# EAGLE schematic keyboardPCB2 (EAGLE 9.2.2)
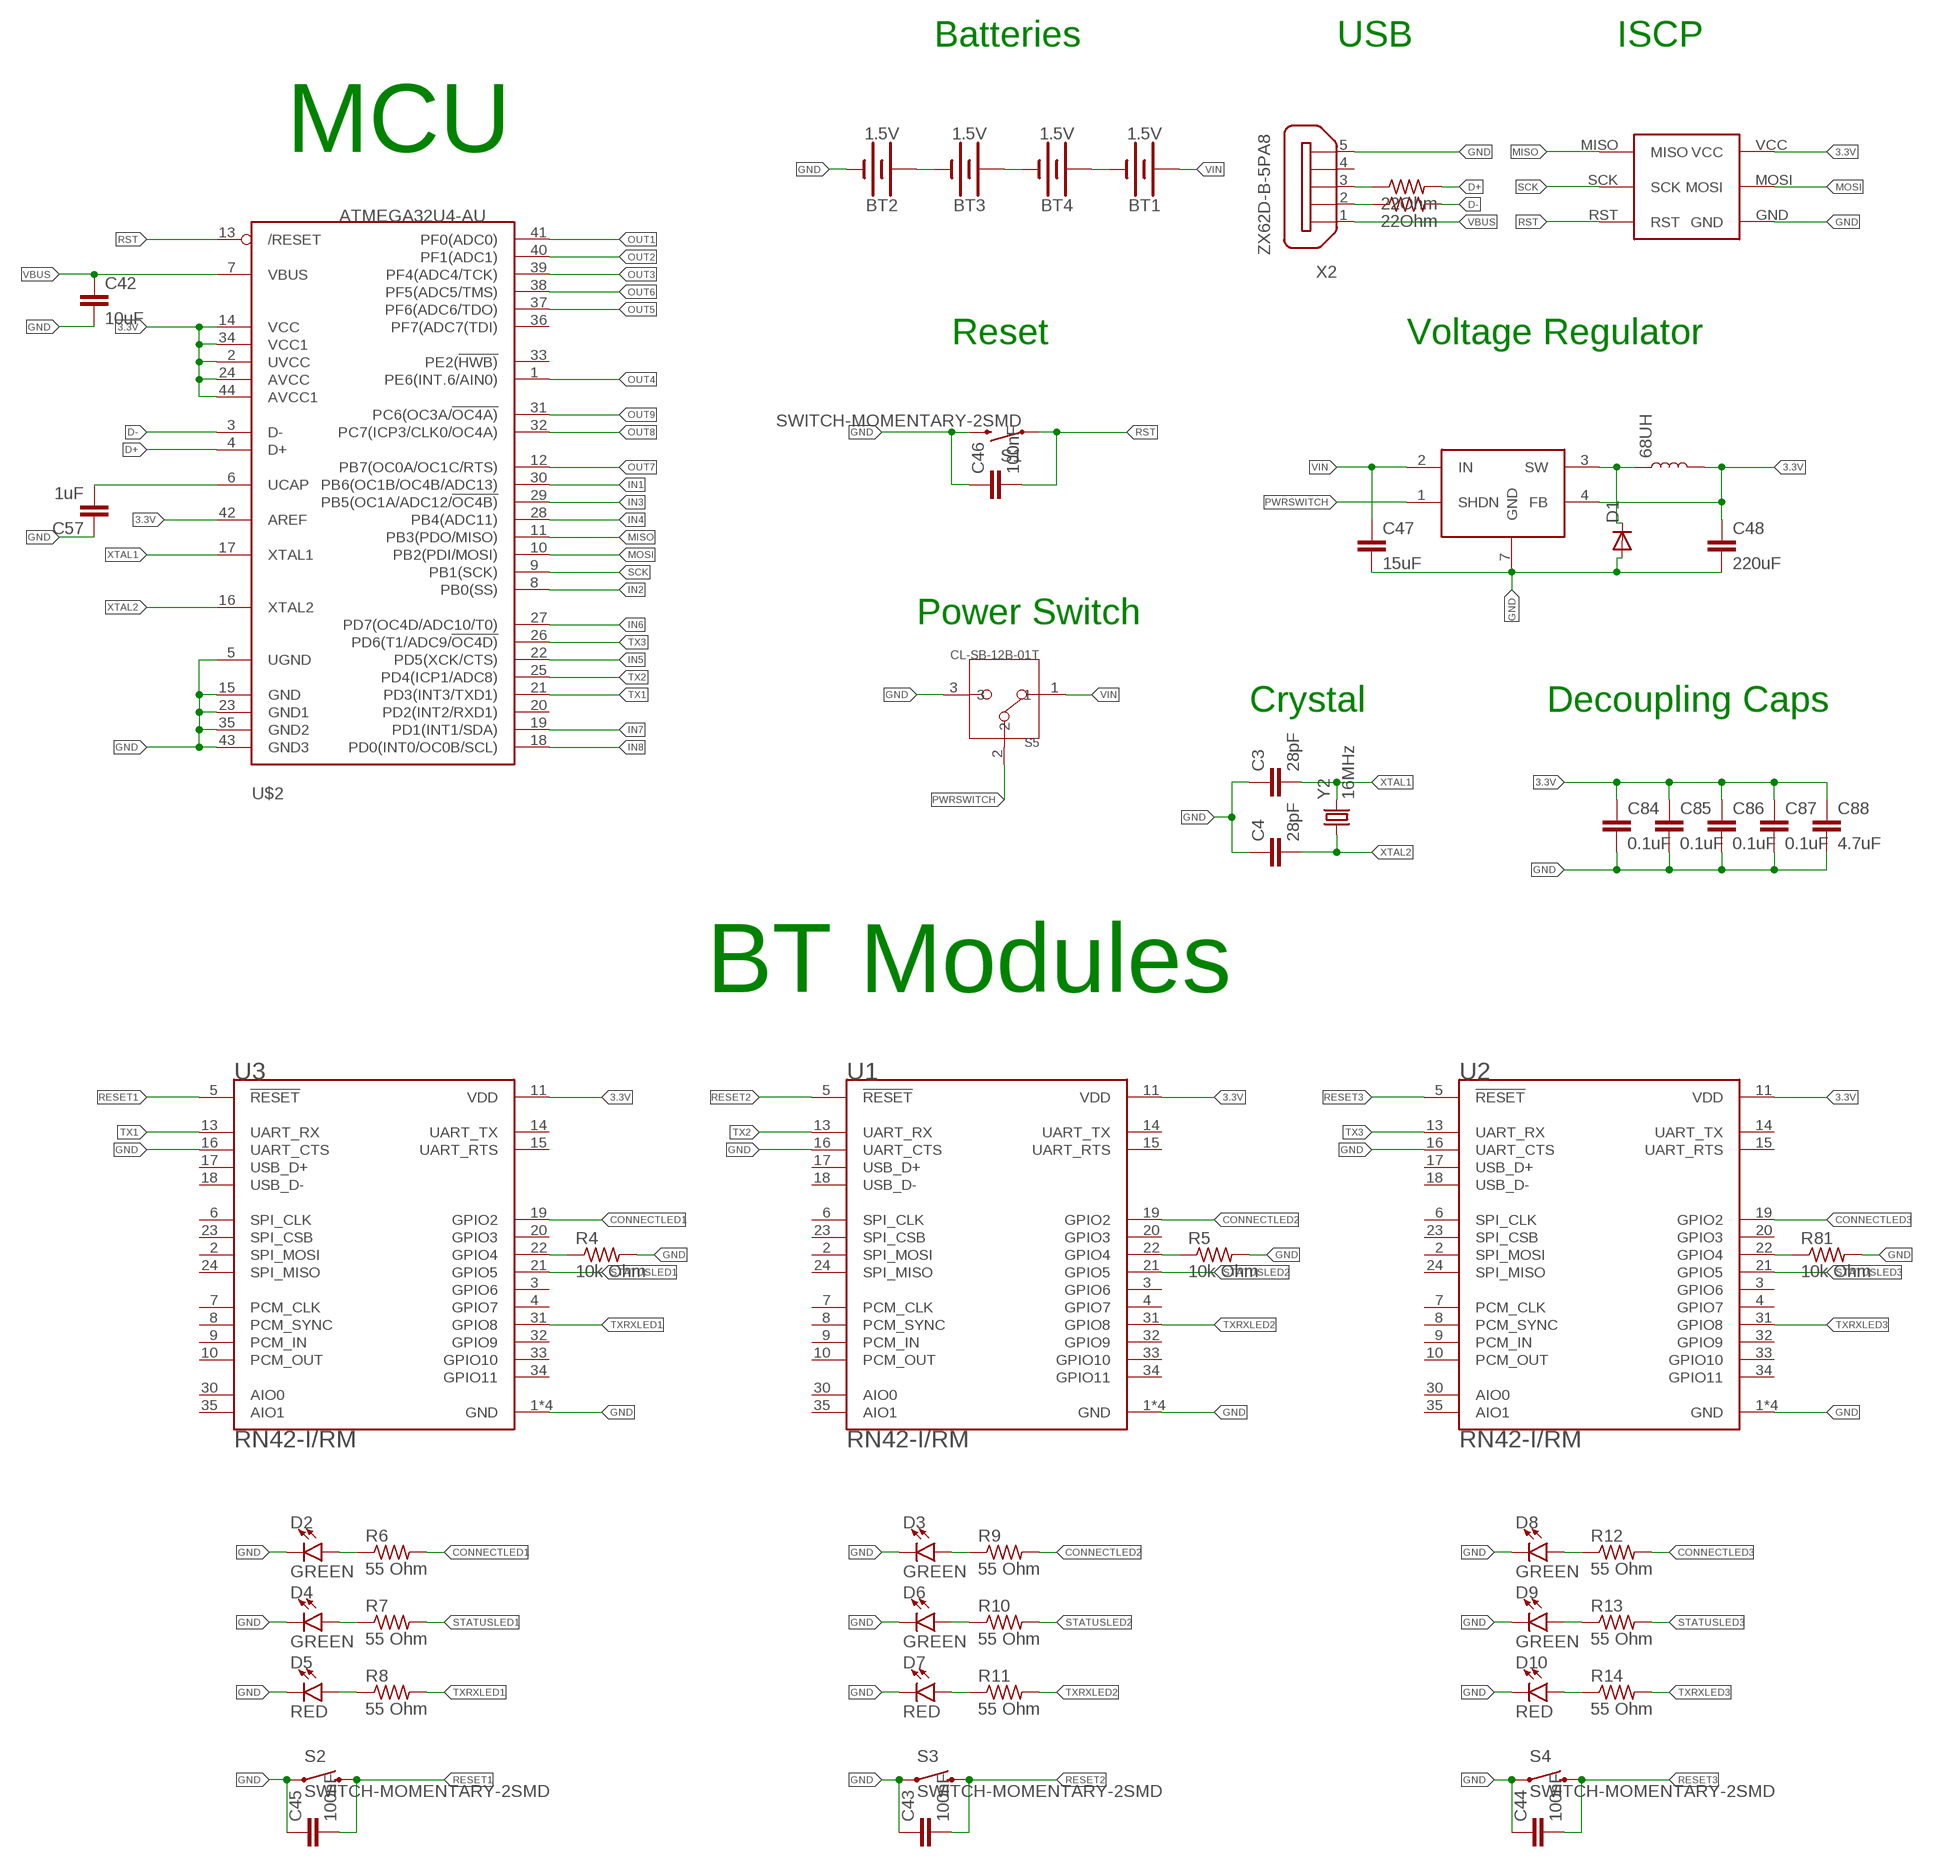
[diagram p0: schematic, sheet 1, part 1 of 2]
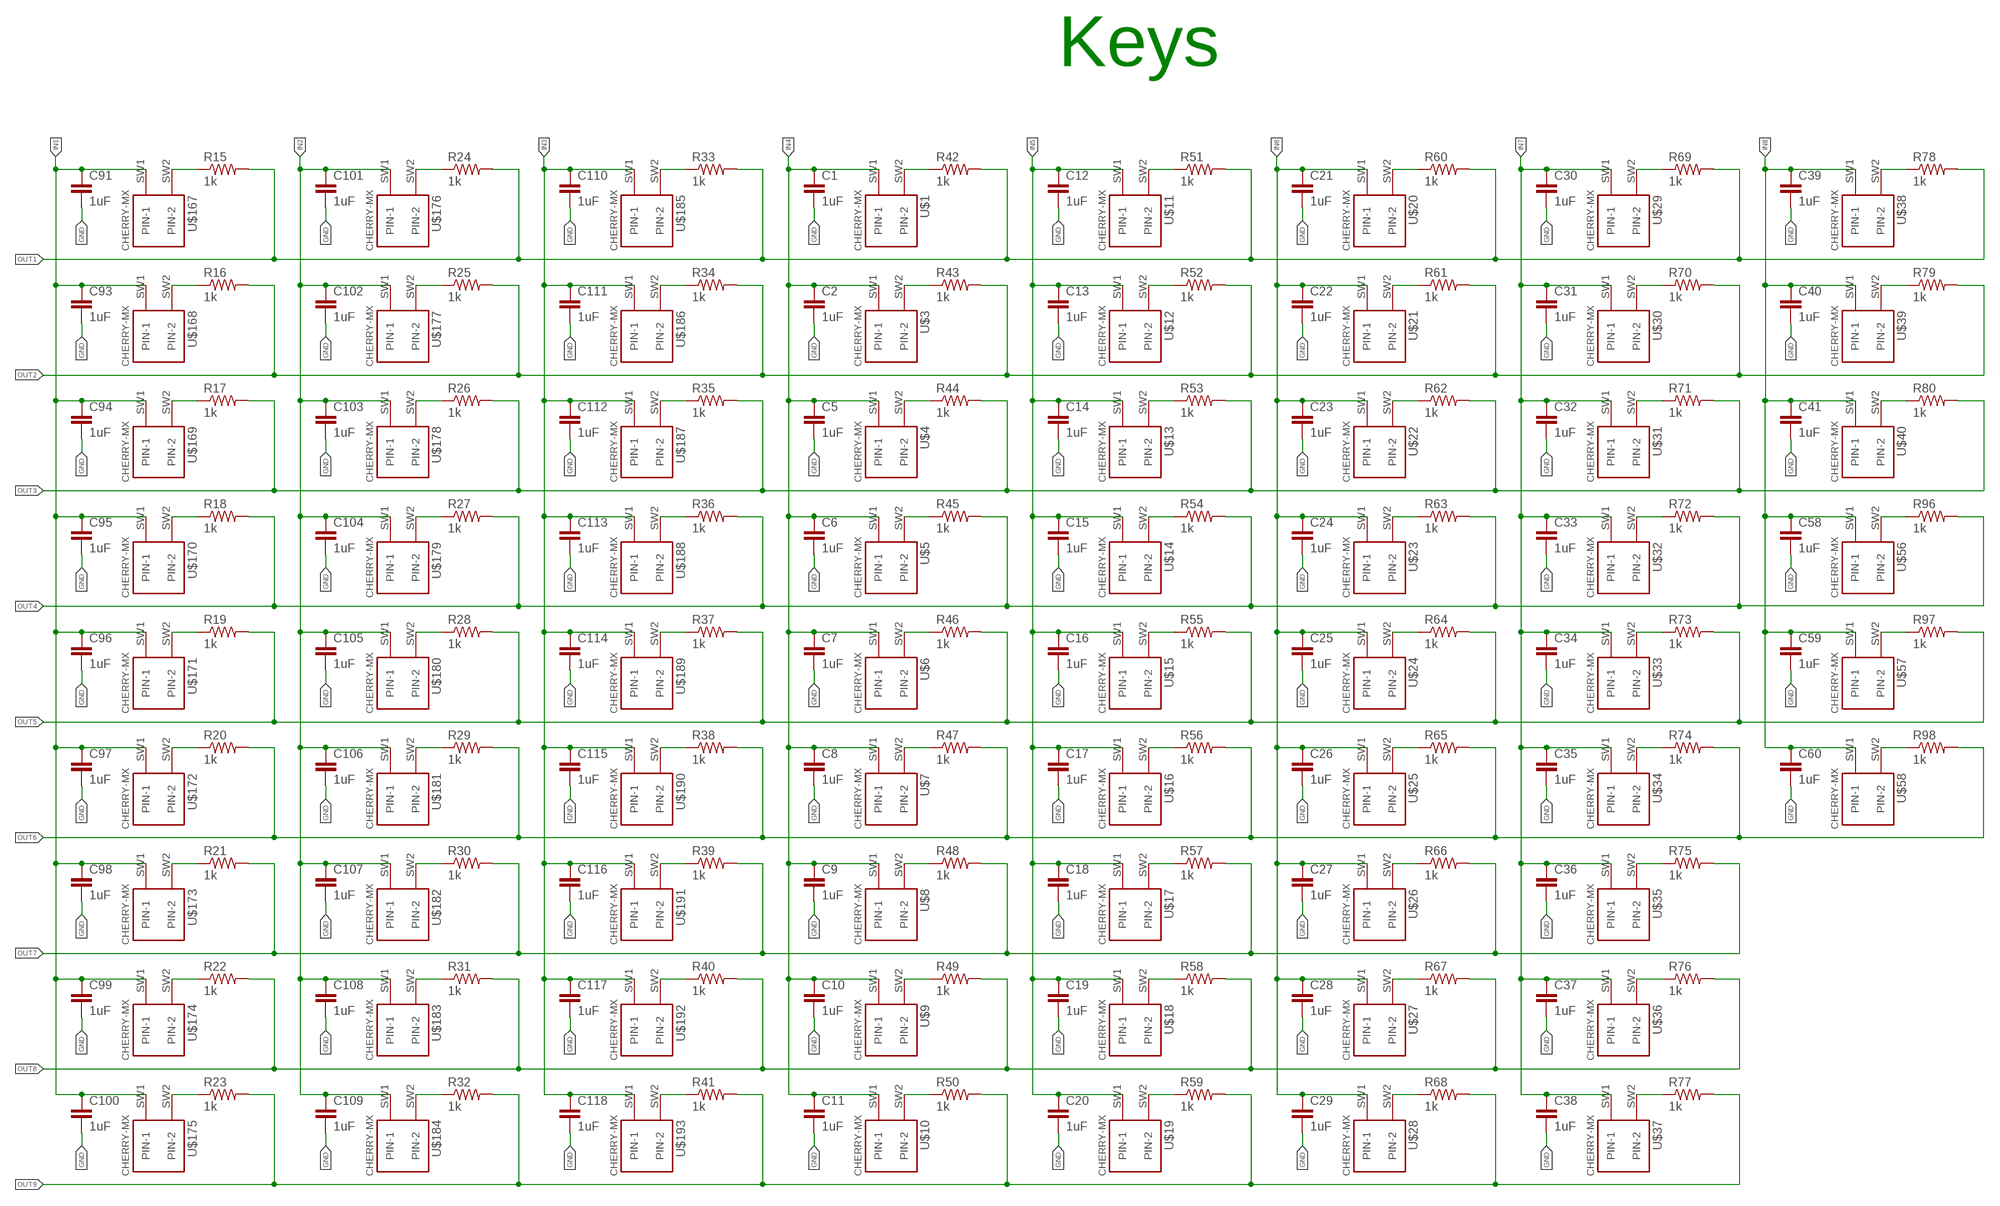
[diagram p1: schematic, sheet 1, part 2 of 2]

## Parts
68UH  33nH/±5%/500mA  INDUCTOR-0603-33NH  [0603]
BT1  1.5V  BATTERY-AA  [BATTERY-AA]
BT2  1.5V  BATTERY-AA  [BATTERY-AA]
BT3  1.5V  BATTERY-AA  [BATTERY-AA]
BT4  1.5V  BATTERY-AA  [BATTERY-AA]
C1  1uF  C-EUC0402K  [C0402K]
C2  1uF  C-EUC0402K  [C0402K]
C3  28pF  C-EUC0402K  [C0402K]
C4  28pF  C-EUC0402K  [C0402K]
C5  1uF  C-EUC0402K  [C0402K]
C6  1uF  C-EUC0402K  [C0402K]
C7  1uF  C-EUC0402K  [C0402K]
C8  1uF  C-EUC0402K  [C0402K]
C9  1uF  C-EUC0402K  [C0402K]
C10  1uF  C-EUC0402K  [C0402K]
C11  1uF  C-EUC0402K  [C0402K]
C12  1uF  C-EUC0402K  [C0402K]
C13  1uF  C-EUC0402K  [C0402K]
C14  1uF  C-EUC0402K  [C0402K]
C15  1uF  C-EUC0402K  [C0402K]
C16  1uF  C-EUC0402K  [C0402K]
C17  1uF  C-EUC0402K  [C0402K]
C18  1uF  C-EUC0402K  [C0402K]
C19  1uF  C-EUC0402K  [C0402K]
C20  1uF  C-EUC0402K  [C0402K]
C21  1uF  C-EUC0402K  [C0402K]
C22  1uF  C-EUC0402K  [C0402K]
C23  1uF  C-EUC0402K  [C0402K]
C24  1uF  C-EUC0402K  [C0402K]
C25  1uF  C-EUC0402K  [C0402K]
C26  1uF  C-EUC0402K  [C0402K]
C27  1uF  C-EUC0402K  [C0402K]
C28  1uF  C-EUC0402K  [C0402K]
C29  1uF  C-EUC0402K  [C0402K]
C30  1uF  C-EUC0402K  [C0402K]
C31  1uF  C-EUC0402K  [C0402K]
C32  1uF  C-EUC0402K  [C0402K]
C33  1uF  C-EUC0402K  [C0402K]
C34  1uF  C-EUC0402K  [C0402K]
C35  1uF  C-EUC0402K  [C0402K]
C36  1uF  C-EUC0402K  [C0402K]
C37  1uF  C-EUC0402K  [C0402K]
C38  1uF  C-EUC0402K  [C0402K]
C39  1uF  C-EUC0402K  [C0402K]
C40  1uF  C-EUC0402K  [C0402K]
C41  1uF  C-EUC0402K  [C0402K]
C42  10uF  C-EUC0402K  [C0402K]
C43  100nF  C-EUC0402K  [C0402K]
C44  100nF  C-EUC0402K  [C0402K]
C45  100nF  C-EUC0402K  [C0402K]
C46  100nF  C-EUC0402K  [C0402K]
C47  15uF  C-EUC0603K  [C0603K]
C48  220uF  C-EUC1206  [C1206]
C57  1uF  C-EUC0402K  [C0402K]
C58  1uF  C-EUC0402K  [C0402K]
C59  1uF  C-EUC0402K  [C0402K]
C60  1uF  C-EUC0402K  [C0402K]
C84  0.1uF  C-EUC0402K  [C0402K]
C85  0.1uF  C-EUC0402K  [C0402K]
C86  0.1uF  C-EUC0402K  [C0402K]
C87  0.1uF  C-EUC0402K  [C0402K]
C88  4.7uF  C-EUC0402K  [C0402K]
C91  1uF  C-EUC0402K  [C0402K]
C93  1uF  C-EUC0402K  [C0402K]
C94  1uF  C-EUC0402K  [C0402K]
C95  1uF  C-EUC0402K  [C0402K]
C96  1uF  C-EUC0402K  [C0402K]
C97  1uF  C-EUC0402K  [C0402K]
C98  1uF  C-EUC0402K  [C0402K]
C99  1uF  C-EUC0402K  [C0402K]
C100  1uF  C-EUC0402K  [C0402K]
C101  1uF  C-EUC0402K  [C0402K]
C102  1uF  C-EUC0402K  [C0402K]
C103  1uF  C-EUC0402K  [C0402K]
C104  1uF  C-EUC0402K  [C0402K]
C105  1uF  C-EUC0402K  [C0402K]
C106  1uF  C-EUC0402K  [C0402K]
C107  1uF  C-EUC0402K  [C0402K]
C108  1uF  C-EUC0402K  [C0402K]
C109  1uF  C-EUC0402K  [C0402K]
C110  1uF  C-EUC0402K  [C0402K]
C111  1uF  C-EUC0402K  [C0402K]
C112  1uF  C-EUC0402K  [C0402K]
C113  1uF  C-EUC0402K  [C0402K]
C114  1uF  C-EUC0402K  [C0402K]
C115  1uF  C-EUC0402K  [C0402K]
C116  1uF  C-EUC0402K  [C0402K]
C117  1uF  C-EUC0402K  [C0402K]
C118  1uF  C-EUC0402K  [C0402K]
D1  S2A  [DO214AA]
D2  GREEN  LED-GREEN0603  [LED-0603]
D3  GREEN  LED-GREEN0603  [LED-0603]
D4  GREEN  LED-GREEN0603  [LED-0603]
D5  RED  LED-RED0603  [LED-0603]
D6  GREEN  LED-GREEN0603  [LED-0603]
D7  RED  LED-RED0603  [LED-0603]
D8  GREEN  LED-GREEN0603  [LED-0603]
D9  GREEN  LED-GREEN0603  [LED-0603]
D10  RED  LED-RED0603  [LED-0603]
R2  22Ohm  R-US_R0402  [R0402]
R3  22Ohm  R-US_R0402  [R0402]
R4  10k Ohm  R-US_R0402  [R0402]
R5  10k Ohm  R-US_R0402  [R0402]
R6  55 Ohm  R-US_R0402  [R0402]
R7  55 Ohm  R-US_R0402  [R0402]
R8  55 Ohm  R-US_R0402  [R0402]
R9  55 Ohm  R-US_R0402  [R0402]
R10  55 Ohm  R-US_R0402  [R0402]
R11  55 Ohm  R-US_R0402  [R0402]
R12  55 Ohm  R-US_R0402  [R0402]
R13  55 Ohm  R-US_R0402  [R0402]
R14  55 Ohm  R-US_R0402  [R0402]
R15  1k  R-US_R0402  [R0402]
R16  1k  R-US_R0402  [R0402]
R17  1k  R-US_R0402  [R0402]
R18  1k  R-US_R0402  [R0402]
R19  1k  R-US_R0402  [R0402]
R20  1k  R-US_R0402  [R0402]
R21  1k  R-US_R0402  [R0402]
R22  1k  R-US_R0402  [R0402]
R23  1k  R-US_R0402  [R0402]
R24  1k  R-US_R0402  [R0402]
R25  1k  R-US_R0402  [R0402]
R26  1k  R-US_R0402  [R0402]
R27  1k  R-US_R0402  [R0402]
R28  1k  R-US_R0402  [R0402]
R29  1k  R-US_R0402  [R0402]
R30  1k  R-US_R0402  [R0402]
R31  1k  R-US_R0402  [R0402]
R32  1k  R-US_R0402  [R0402]
R33  1k  R-US_R0402  [R0402]
R34  1k  R-US_R0402  [R0402]
R35  1k  R-US_R0402  [R0402]
R36  1k  R-US_R0402  [R0402]
R37  1k  R-US_R0402  [R0402]
R38  1k  R-US_R0402  [R0402]
R39  1k  R-US_R0402  [R0402]
R40  1k  R-US_R0402  [R0402]
R41  1k  R-US_R0402  [R0402]
R42  1k  R-US_R0402  [R0402]
R43  1k  R-US_R0402  [R0402]
R44  1k  R-US_R0402  [R0402]
R45  1k  R-US_R0402  [R0402]
R46  1k  R-US_R0402  [R0402]
R47  1k  R-US_R0402  [R0402]
R48  1k  R-US_R0402  [R0402]
R49  1k  R-US_R0402  [R0402]
R50  1k  R-US_R0402  [R0402]
R51  1k  R-US_R0402  [R0402]
R52  1k  R-US_R0402  [R0402]
R53  1k  R-US_R0402  [R0402]
R54  1k  R-US_R0402  [R0402]
R55  1k  R-US_R0402  [R0402]
R56  1k  R-US_R0402  [R0402]
R57  1k  R-US_R0402  [R0402]
R58  1k  R-US_R0402  [R0402]
R59  1k  R-US_R0402  [R0402]
R60  1k  R-US_R0402  [R0402]
R61  1k  R-US_R0402  [R0402]
R62  1k  R-US_R0402  [R0402]
R63  1k  R-US_R0402  [R0402]
R64  1k  R-US_R0402  [R0402]
R65  1k  R-US_R0402  [R0402]
R66  1k  R-US_R0402  [R0402]
R67  1k  R-US_R0402  [R0402]
R68  1k  R-US_R0402  [R0402]
R69  1k  R-US_R0402  [R0402]
R70  1k  R-US_R0402  [R0402]
R71  1k  R-US_R0402  [R0402]
R72  1k  R-US_R0402  [R0402]
R73  1k  R-US_R0402  [R0402]
R74  1k  R-US_R0402  [R0402]
R75  1k  R-US_R0402  [R0402]
R76  1k  R-US_R0402  [R0402]
R77  1k  R-US_R0402  [R0402]
R78  1k  R-US_R0402  [R0402]
R79  1k  R-US_R0402  [R0402]
R80  1k  R-US_R0402  [R0402]
R81  10k Ohm  R-US_R0402  [R0402]
R96  1k  R-US_R0402  [R0402]
R97  1k  R-US_R0402  [R0402]
R98  1k  R-US_R0402  [R0402]
S1  SWITCH-MOMENTARY-2SMD  [TACTILE-SWITCH-SMD]
S2  SWITCH-MOMENTARY-2SMD  [TACTILE-SWITCH-SMD]
S3  SWITCH-MOMENTARY-2SMD  [TACTILE-SWITCH-SMD]
S4  SWITCH-MOMENTARY-2SMD  [TACTILE-SWITCH-SMD]
S5  CL-SB-12B-01T  [CL-SB-12B]
U1  RN42-I/RM  [XCVR_RN42-I/RM]
U2  RN42-I/RM  [XCVR_RN42-I/RM]
U3  RN42-I/RM  [XCVR_RN42-I/RM]
U$1  CHERRY-MX  [CHERRY-MX]
U$2  ATMEGA32U4-AU  [TQFP44]
U$3  CHERRY-MX  [CHERRY-MX]
U$4  CHERRY-MX  [CHERRY-MX]
U$5  CHERRY-MX  [CHERRY-MX]
U$6  CHERRY-MX  [CHERRY-MX]
U$7  CHERRY-MX  [CHERRY-MX]
U$8  CHERRY-MX  [CHERRY-MX]
U$9  CHERRY-MX  [CHERRY-MX]
U$10  CHERRY-MX  [CHERRY-MX]
U$11  CHERRY-MX  [CHERRY-MX]
U$12  CHERRY-MX  [CHERRY-MX]
U$13  CHERRY-MX  [CHERRY-MX]
U$14  CHERRY-MX  [CHERRY-MX]
U$15  CHERRY-MX  [CHERRY-MX]
U$16  CHERRY-MX  [CHERRY-MX]
U$17  CHERRY-MX  [CHERRY-MX]
U$18  CHERRY-MX  [CHERRY-MX]
U$19  CHERRY-MX  [CHERRY-MX]
U$20  CHERRY-MX  [CHERRY-MX]
U$21  CHERRY-MX  [CHERRY-MX]
U$22  CHERRY-MX  [CHERRY-MX]
U$23  CHERRY-MX  [CHERRY-MX]
U$24  CHERRY-MX  [CHERRY-MX]
U$25  CHERRY-MX  [CHERRY-MX]
U$26  CHERRY-MX  [CHERRY-MX]
U$27  CHERRY-MX  [CHERRY-MX]
U$28  CHERRY-MX  [CHERRY-MX]
U$29  CHERRY-MX  [CHERRY-MX]
U$30  CHERRY-MX  [CHERRY-MX]
U$31  CHERRY-MX  [CHERRY-MX]
U$32  CHERRY-MX  [CHERRY-MX]
U$33  CHERRY-MX  [CHERRY-MX]
U$34  CHERRY-MX  [CHERRY-MX]
U$35  CHERRY-MX  [CHERRY-MX]
U$36  CHERRY-MX  [CHERRY-MX]
U$37  CHERRY-MX  [CHERRY-MX]
U$38  CHERRY-MX  [CHERRY-MX]
U$39  CHERRY-MX  [CHERRY-MX]
U$40  CHERRY-MX  [CHERRY-MX]
U$56  CHERRY-MX  [CHERRY-MX]
U$57  CHERRY-MX  [CHERRY-MX]
U$58  CHERRY-MX  [CHERRY-MX]
U$59  AVR-ISP  [AVR-ISP]
U$166  MIC4680  [SOIC-8]
U$167  CHERRY-MX  [CHERRY-MX]
U$168  CHERRY-MX  [CHERRY-MX]
U$169  CHERRY-MX  [CHERRY-MX]
U$170  CHERRY-MX  [CHERRY-MX]
U$171  CHERRY-MX  [CHERRY-MX]
U$172  CHERRY-MX  [CHERRY-MX]
U$173  CHERRY-MX  [CHERRY-MX]
U$174  CHERRY-MX  [CHERRY-MX]
U$175  CHERRY-MX  [CHERRY-MX]
U$176  CHERRY-MX  [CHERRY-MX]
U$177  CHERRY-MX  [CHERRY-MX]
U$178  CHERRY-MX  [CHERRY-MX]
U$179  CHERRY-MX  [CHERRY-MX]
U$180  CHERRY-MX  [CHERRY-MX]
U$181  CHERRY-MX  [CHERRY-MX]
U$182  CHERRY-MX  [CHERRY-MX]
U$183  CHERRY-MX  [CHERRY-MX]
U$184  CHERRY-MX  [CHERRY-MX]
U$185  CHERRY-MX  [CHERRY-MX]
U$186  CHERRY-MX  [CHERRY-MX]
U$187  CHERRY-MX  [CHERRY-MX]
U$188  CHERRY-MX  [CHERRY-MX]
U$189  CHERRY-MX  [CHERRY-MX]
U$190  CHERRY-MX  [CHERRY-MX]
U$191  CHERRY-MX  [CHERRY-MX]
U$192  CHERRY-MX  [CHERRY-MX]
U$193  CHERRY-MX  [CHERRY-MX]
X2  ZX62D-B-5PA8  [ZX62D-B-5PA8]
Y2  16MHz  CRYSTALSMD  [HC49UP]

## Nets
3.3V: 68UH.2 C48.1 C84.1 C85.1 C86.1 C87.1 C88.1 U1.11(VDD) U2.11(VDD) U3.11(VDD) U$2.2(UVCC) U$2.14(VCC) U$2.24(AVCC) U$2.34(VCC1) U$2.42(AREF) U$2.44(AVCC1) U$59.VCC U$166.4(FB)
CONNECTLED1: R6.2 U3.19(GPIO2)
CONNECTLED2: R9.2 U1.19(GPIO2)
CONNECTLED3: R12.2 U2.19(GPIO2)
D+: R2.2 U$2.4(D+)
D-: R3.2 U$2.3(D-)
GND: BT2.GND@1(-) C1.2 C2.2 C3.1 C4.1 C5.2 C6.2 C7.2 C8.2 C9.2 C10.2 C11.2 C12.2 C13.2 C14.2 C15.2 C16.2 C17.2 C18.2 C19.2 C20.2 C21.2 C22.2 C23.2 C24.2 C25.2 C26.2 C27.2 C28.2 C29.2 C30.2 C31.2 C32.2 C33.2 C34.2 C35.2 C36.2 C37.2 C38.2 C39.2 C40.2 C41.2 C42.2 C43.1 C44.1 C45.1 C46.1 C47.2 C48.2 C57.1 C58.2 C59.2 C60.2 C84.2 C85.2 C86.2 C87.2 C88.2 C91.2 C93.2 C94.2 C95.2 C96.2 C97.2 C98.2 C99.2 C100.2 C101.2 C102.2 C103.2 C104.2 C105.2 C106.2 C107.2 C108.2 C109.2 C110.2 C111.2 C112.2 C113.2 C114.2 C115.2 C116.2 C117.2 C118.2 D1.A D2.C D3.C D4.C D5.C D6.C D7.C D8.C D9.C D10.C R4.2 R5.2 R81.2 S1.3 S2.1 S3.1 S4.1 S5.3 U1.1(GND) U1.12(GND) U1.16(UART_CTS) U1.28(GND) U1.29(GND) U2.1(GND) U2.12(GND) U2.16(UART_CTS) U2.28(GND) U2.29(GND) U3.1(GND) U3.12(GND) U3.16(UART_CTS) U3.28(GND) U3.29(GND) U$2.5(UGND) U$2.15(GND) U$2.23(GND1) U$2.35(GND2) U$2.43(GND3) U$59.GND U$166.5(GND) U$166.6(GND) U$166.7(GND) U$166.8(GND) X2.5
IN1: C91.1 C93.1 C94.1 C95.1 C96.1 C97.1 C98.1 C99.1 C100.1 U$2.30(PB6(OC1B/OC4B/ADC13)) U$167.SW1(PIN-1) U$168.SW1(PIN-1) U$169.SW1(PIN-1) U$170.SW1(PIN-1) U$171.SW1(PIN-1) U$172.SW1(PIN-1) U$173.SW1(PIN-1) U$174.SW1(PIN-1) U$175.SW1(PIN-1)
IN2: C101.1 C102.1 C103.1 C104.1 C105.1 C106.1 C107.1 C108.1 C109.1 U$2.8(PB0(SS)) U$176.SW1(PIN-1) U$177.SW1(PIN-1) U$178.SW1(PIN-1) U$179.SW1(PIN-1) U$180.SW1(PIN-1) U$181.SW1(PIN-1) U$182.SW1(PIN-1) U$183.SW1(PIN-1) U$184.SW1(PIN-1)
IN3: C110.1 C111.1 C112.1 C113.1 C114.1 C115.1 C116.1 C117.1 C118.1 U$2.29(PB5(OC1A/ADC12/!OC4B)) U$185.SW1(PIN-1) U$186.SW1(PIN-1) U$187.SW1(PIN-1) U$188.SW1(PIN-1) U$189.SW1(PIN-1) U$190.SW1(PIN-1) U$191.SW1(PIN-1) U$192.SW1(PIN-1) U$193.SW1(PIN-1)
IN4: C1.1 C2.1 C5.1 C6.1 C7.1 C8.1 C9.1 C10.1 C11.1 U$1.SW1(PIN-1) U$2.28(PB4(ADC11)) U$3.SW1(PIN-1) U$4.SW1(PIN-1) U$5.SW1(PIN-1) U$6.SW1(PIN-1) U$7.SW1(PIN-1) U$8.SW1(PIN-1) U$9.SW1(PIN-1) U$10.SW1(PIN-1)
IN5: C12.1 C13.1 C14.1 C15.1 C16.1 C17.1 C18.1 C19.1 C20.1 U$2.22(PD5(XCK/CTS)) U$11.SW1(PIN-1) U$12.SW1(PIN-1) U$13.SW1(PIN-1) U$14.SW1(PIN-1) U$15.SW1(PIN-1) U$16.SW1(PIN-1) U$17.SW1(PIN-1) U$18.SW1(PIN-1) U$19.SW1(PIN-1)
IN6: C21.1 C22.1 C23.1 C24.1 C25.1 C26.1 C27.1 C28.1 C29.1 U$2.27(PD7(OC4D/ADC10/T0)) U$20.SW1(PIN-1) U$21.SW1(PIN-1) U$22.SW1(PIN-1) U$23.SW1(PIN-1) U$24.SW1(PIN-1) U$25.SW1(PIN-1) U$26.SW1(PIN-1) U$27.SW1(PIN-1) U$28.SW1(PIN-1)
IN7: C30.1 C31.1 C32.1 C33.1 C34.1 C35.1 C36.1 C37.1 C38.1 U$2.19(PD1(INT1/SDA)) U$29.SW1(PIN-1) U$30.SW1(PIN-1) U$31.SW1(PIN-1) U$32.SW1(PIN-1) U$33.SW1(PIN-1) U$34.SW1(PIN-1) U$35.SW1(PIN-1) U$36.SW1(PIN-1) U$37.SW1(PIN-1)
IN8: C39.1 C40.1 C41.1 C58.1 C59.1 C60.1 U$2.18(PD0(INT0/OC0B/SCL)) U$38.SW1(PIN-1) U$39.SW1(PIN-1) U$40.SW1(PIN-1) U$56.SW1(PIN-1) U$57.SW1(PIN-1) U$58.SW1(PIN-1)
MISO: U$2.11(PB3(PDO/MISO)) U$59.MISO
MOSI: U$2.10(PB2(PDI/MOSI)) U$59.MOSI
N$2: R42.1 U$1.SW2(PIN-2)
N$3: BT2.PWR@1(+) BT3.GND@1(-)
N$4: C57.2 U$2.6(UCAP)
N$5: BT3.PWR@1(+) BT4.GND@1(-)
N$6: R96.1 U$56.SW2(PIN-2)
N$7: R43.1 U$3.SW2(PIN-2)
N$8: R4.1 U3.22(GPIO4)
N$9: R97.1 U$57.SW2(PIN-2)
N$10: D2.A R6.1
N$11: D4.A R7.1
N$12: R44.1 U$4.SW2(PIN-2)
N$13: R98.1 U$58.SW2(PIN-2)
N$14: BT1.GND@1(-) BT4.PWR@1(+)
N$15: R45.1 U$5.SW2(PIN-2)
N$16: D5.A R8.1
N$17: 68UH.1 D1.C U$166.3(SW)
N$18: R46.1 U$6.SW2(PIN-2)
N$20: R47.1 U$7.SW2(PIN-2)
N$21: D3.A R9.1
N$22: D6.A R10.1
N$24: D7.A R11.1
N$25: D8.A R12.1
N$26: R48.1 U$8.SW2(PIN-2)
N$27: D9.A R13.1
N$28: R5.1 U1.22(GPIO4)
N$29: R49.1 U$9.SW2(PIN-2)
N$30: D10.A R14.1
N$31: R50.1 U$10.SW2(PIN-2)
N$32: R2.1 X2.3
N$33: R51.1 U$11.SW2(PIN-2)
N$35: R52.1 U$12.SW2(PIN-2)
N$37: R53.1 U$13.SW2(PIN-2)
N$38: R54.1 U$14.SW2(PIN-2)
N$39: R24.1 U$176.SW2(PIN-2)
N$40: R55.1 U$15.SW2(PIN-2)
N$41: R15.1 U$167.SW2(PIN-2)
N$42: R56.1 U$16.SW2(PIN-2)
N$43: R57.1 U$17.SW2(PIN-2)
N$44: R58.1 U$18.SW2(PIN-2)
N$45: R3.1 X2.2
N$46: R59.1 U$19.SW2(PIN-2)
N$47: R60.1 U$20.SW2(PIN-2)
N$48: R61.1 U$21.SW2(PIN-2)
N$49: R62.1 U$22.SW2(PIN-2)
N$50: R63.1 U$23.SW2(PIN-2)
N$51: R64.1 U$24.SW2(PIN-2)
N$52: R65.1 U$25.SW2(PIN-2)
N$53: R66.1 U$26.SW2(PIN-2)
N$54: R67.1 U$27.SW2(PIN-2)
N$55: R16.1 U$168.SW2(PIN-2)
N$56: R68.1 U$28.SW2(PIN-2)
N$57: R69.1 U$29.SW2(PIN-2)
N$58: R81.1 U2.22(GPIO4)
N$59: R25.1 U$177.SW2(PIN-2)
N$61: R70.1 U$30.SW2(PIN-2)
N$63: R71.1 U$31.SW2(PIN-2)
N$65: R72.1 U$32.SW2(PIN-2)
N$67: R73.1 U$33.SW2(PIN-2)
N$69: R17.1 U$169.SW2(PIN-2)
N$70: R74.1 U$34.SW2(PIN-2)
N$72: R75.1 U$35.SW2(PIN-2)
N$74: R76.1 U$36.SW2(PIN-2)
N$76: R77.1 U$37.SW2(PIN-2)
N$78: R78.1 U$38.SW2(PIN-2)
N$80: R79.1 U$39.SW2(PIN-2)
N$81: R80.1 U$40.SW2(PIN-2)
N$82: R18.1 U$170.SW2(PIN-2)
N$86: R26.1 U$178.SW2(PIN-2)
N$88: R19.1 U$171.SW2(PIN-2)
N$95: R20.1 U$172.SW2(PIN-2)
N$98: R27.1 U$179.SW2(PIN-2)
N$108: R21.1 U$173.SW2(PIN-2)
N$120: R22.1 U$174.SW2(PIN-2)
N$122: R28.1 U$180.SW2(PIN-2)
N$123: R23.1 U$175.SW2(PIN-2)
N$126: R29.1 U$181.SW2(PIN-2)
N$128: R30.1 U$182.SW2(PIN-2)
N$130: R31.1 U$183.SW2(PIN-2)
N$132: R32.1 U$184.SW2(PIN-2)
N$134: R33.1 U$185.SW2(PIN-2)
N$136: R34.1 U$186.SW2(PIN-2)
N$138: R35.1 U$187.SW2(PIN-2)
N$140: R36.1 U$188.SW2(PIN-2)
N$142: R37.1 U$189.SW2(PIN-2)
N$144: R38.1 U$190.SW2(PIN-2)
N$146: R39.1 U$191.SW2(PIN-2)
N$148: R40.1 U$192.SW2(PIN-2)
N$150: R41.1 U$193.SW2(PIN-2)
OUT1: R15.2 R24.2 R33.2 R42.2 R51.2 R60.2 R69.2 R78.2 U$2.41(PF0(ADC0))
OUT2: R16.2 R25.2 R34.2 R43.2 R52.2 R61.2 R70.2 R79.2 U$2.40(PF1(ADC1))
OUT3: R17.2 R26.2 R35.2 R44.2 R53.2 R62.2 R71.2 R80.2 U$2.39(PF4(ADC4/TCK))
OUT4: R18.2 R27.2 R36.2 R45.2 R54.2 R63.2 R72.2 R96.2 U$2.1(PE6(INT.6/AIN0))
OUT5: R19.2 R28.2 R37.2 R46.2 R55.2 R64.2 R73.2 R97.2 U$2.37(PF6(ADC6/TDO))
OUT6: R20.2 R29.2 R38.2 R47.2 R56.2 R65.2 R74.2 R98.2 U$2.38(PF5(ADC5/TMS))
OUT7: R21.2 R30.2 R39.2 R48.2 R57.2 R66.2 R75.2 U$2.12(PB7(OC0A/OC1C/RTS))
OUT8: R22.2 R31.2 R40.2 R49.2 R58.2 R67.2 R76.2 U$2.32(PC7(ICP3/CLK0/OC4A))
OUT9: R23.2 R32.2 R41.2 R50.2 R59.2 R68.2 R77.2 U$2.31(PC6(OC3A/!OC4A))
PWRSWITCH: S5.2 U$166.1(SHDN)
RESET1: C45.2 S2.3 U3.5(!RESET)
RESET2: C43.2 S3.3 U1.5(!RESET)
RESET3: C44.2 S4.3 U2.5(!RESET)
RST: C46.2 S1.1 U$2.13(/RESET) U$59.RST
SCK: U$2.9(PB1(SCK)) U$59.SCK
STATUSLED1: R7.2 U3.21(GPIO5)
STATUSLED2: R10.2 U1.21(GPIO5)
STATUSLED3: R13.2 U2.21(GPIO5)
TX1: U3.13(UART_RX) U$2.21(PD3(INT3/TXD1))
TX2: U1.13(UART_RX) U$2.25(PD4(ICP1/ADC8))
TX3: U2.13(UART_RX) U$2.26(PD6(T1/ADC9/!OC4D))
TXRXLED1: R8.2 U3.31(GPIO8)
TXRXLED2: R11.2 U1.31(GPIO8)
TXRXLED3: R14.2 U2.31(GPIO8)
VBUS: C42.1 U$2.7(VBUS) X2.1
VIN: BT1.PWR@1(+) C47.1 S5.1 U$166.2(IN)
XTAL1: C3.2 U$2.17(XTAL1) Y2.2
XTAL2: C4.2 U$2.16(XTAL2) Y2.1
Unconnected: U1.2(SPI_MOSI) U1.3(GPIO6) U1.4(GPIO7) U1.6(SPI_CLK) U1.7(PCM_CLK) U1.8(PCM_SYNC) U1.9(PCM_IN) U1.10(PCM_OUT) U1.14(UART_TX) U1.15(UART_RTS) U1.17(USB_D+) U1.18(USB_D-) U1.20(GPIO3) U1.23(SPI_CSB) U1.24(SPI_MISO) U1.30(AIO0) U1.32(GPIO9) U1.33(GPIO10) U1.34(GPIO11) U1.35(AIO1) U2.2(SPI_MOSI) U2.3(GPIO6) U2.4(GPIO7) U2.6(SPI_CLK) U2.7(PCM_CLK) U2.8(PCM_SYNC) U2.9(PCM_IN) U2.10(PCM_OUT) U2.14(UART_TX) U2.15(UART_RTS) U2.17(USB_D+) U2.18(USB_D-) U2.20(GPIO3) U2.23(SPI_CSB) U2.24(SPI_MISO) U2.30(AIO0) U2.32(GPIO9) U2.33(GPIO10) U2.34(GPIO11) U2.35(AIO1) U3.2(SPI_MOSI) U3.3(GPIO6) U3.4(GPIO7) U3.6(SPI_CLK) U3.7(PCM_CLK) U3.8(PCM_SYNC) U3.9(PCM_IN) U3.10(PCM_OUT) U3.14(UART_TX) U3.15(UART_RTS) U3.17(USB_D+) U3.18(USB_D-) U3.20(GPIO3) U3.23(SPI_CSB) U3.24(SPI_MISO) U3.30(AIO0) U3.32(GPIO9) U3.33(GPIO10) U3.34(GPIO11) U3.35(AIO1) U$2.20(PD2(INT2/RXD1)) U$2.33(PE2(!HWB)) U$2.36(PF7(ADC7(TDI)) X2.4 X2.S1 X2.S2 X2.S3 X2.S4

## Notes on the sheet
- Batteries | USB | ISCP
- Keys
- MCU
- Reset | Voltage Regulator
- Power Switch
- Crystal | Decoupling Caps
- BT Modules

## Library data of the parts
68UH = SparkFun-Coils:INDUCTOR: Inductors Resist changes in electrical current. Basically a coil of wire. SparkFun Products: SparkFun Load Cell Amplifier - HX711 <https://www.sparkfun.com/products/13879> IOIO-OTG - V2.2 <https://www.sparkfun.com/products/13613>; PROD_ID: NDUC-07874
BT1-BT4 = SparkFun-Batteries:BATTERY: Battery - Single Cell A variety of battery chemistries, sizes, and footprints. Device List: 20MM_PTH - Coin Cell Battery Holder - 20mm (PTH) <https://www.sparkfun.com/products/783> 6.8MM_PTH - Coin Cell Battery Holder - 6.8MM(SMD) <https://www.digikey.com/product-detail/en/seiko-instruments/MS621FE-FL11E/728-1057-ND/1889208?WT.srch=1&gclid=CNOQ5a6LzdQCFZS2wAodXCkE0g> 12MM_SMD - Coin Cell Battery Holder - 12mm (SMD) <https://www.sparkfun.com/products/10592> 12MM_PTH - Coin Cell Battery Holder - 12mm (PTH) <https://www.sparkfun.com/products/7948> 20MM_SMD - 20mm Coin Cell Battery Holder (SMD) (2 legs) Used on the Big Time Watch Kit <https://www.sparkfun.com/products/11734> 20MM_SMD_4LEGS - Coin Cell Battery Holder - 20mm (SMD) <https://www.sparkfun.com/products/11892> 20MM_SMD_4LEGS_OVERPASTE - Coin Cell Battery Holder - 20mm (SMD) <https://www.sparkfun.com/products/11892> (Over-paste on the legs) 24.5MM_PTH - Coin Cell Battery Holder - 24.5mm (PTH) <https://www.sparkfun.com/products/8863> 9V - 9V Battery Holder - PC Mount Used on the SparkFun SparkPunk Sound Kit <https://www.sparkfun.com/products/11177> and SparkFun SparkPunk Sequencer Kit <https://www.sparkfun.com/products/12707> 18650 - Battery Holder - 18650 (PTH) <https://www.sparkfun.com/products/13113> AA - Battery Holder - 1xAA (PTH) <https://www.sparkfun.com/products/7949> AAA - Battery Holder - 1xAAA (PTH) <https://www.sparkfun.com/products/12718> AA_KIT - Battery Holder - 1xAA (PTH) <https://www.sparkfun.com/products/7949> Special kit package - pads only have exposed copper on one side of the board. AAA_KIT - Battery Holder - 1xAAA (PTH) <https://www.sparkfun.com/products/12718> Special kit package - pads only have exposed copper on one side of the board.; PROD_ID: BATT-08316; SF_SKU: PRT-07949
C1-C46 C57-C60 C84-C88 C91 C93-C118 = resistor:C-EU: CAPACITOR, European symbol
C47 C48 = rcl:C-EU: CAPACITOR, European symbol; SPICEPREFIX: C
D1 = s2x_10:S2*: S2A - S2M General Purpose Rectifiers Source: http://www.fairchildsemi.com/datasheets/S2/S2A.pdf; MF: Fairchild; MPN: S2A; OC_FARNELL: 1467485; OC_NEWARK: 58K2391
D2-D4 D6 D8 D9 = SparkFun-LED:LED-GREEN: Green SMD LED Used in manufacturing of various products at SparkFun Packages: 0603 - SMD 0603 package [Product Link] <http://www.futureelectronics.com/en/technologies/semiconductors/optoelectronics/leds/Pages/9894312-LTST-C190GKT.aspx?CrossPart=HSMG-C190&IM=0> LilyPad 1206 - SMD1206 LilyPad package [Product Link] <http://www.futureelectronics.com/en/Technologies/Product.aspx?ProductID=IN150NGHARVATEKCORPORATION2049943&IM=0> 1206 - SMD1206 package [Product Link] <http://www.futureelectronics.com/en/technologies/semiconductors/optoelectronics/leds/Pages/8315665-LTST-C150KGKT.aspx?IM=0> 1206 Bottom Mount -SMD 1206 Bottom Mount [Product Link] <http://www.digikey.com/product-detail/en/lite-on-inc/LTST-C230KGKT/160-1456-1-ND/386854> SparkFun Products: Pro Mini 328 -5V <https://www.sparkfun.com/products/821> RedBoard <https://www.sparkfun.com/products/12757> MP3 Trigger <https://www.sparkfun.com/products/13720> Makey Makey <https://www.sparkfun.com/products/11076>; PROD_ID: DIO-00821
D5 D7 D10 = SparkFun-LED:LED-RED: Red SMD LED Used in manufacturing of most products at SparkFun Packages: 0603 - SMD 0603 package [Product Link] <http://docs.avagotech.com/docs/AV02-0551EN> 0603 SMART - SMD 0603 SMART package ( more efficient and expensive)[Product Link] <http://www.osram-os.com/Graphics/XPic2/00077099_0.pdf> 1206 - SMD1206 package [Product Link] <https://www.sparkfun.com/datasheets/DevTools/LilyPad/Q150OVS4.pdff> SparkFun Products: Pro Mini 328 -5V <https://www.sparkfun.com/products/821> RedBoard <https://www.sparkfun.com/products/12757> IOIO-OTG <https://www.sparkfun.com/products/13613>; PROD_ID: DIO-00819
R2-R81 R96-R98 = resistor:R-US_: RESISTOR, American symbol
S1-S4 = quad:SWITCH-MOMENTARY-2: Various NO switches- pushbuttons, reed, etc; PROD_ID: SWCH-08247
S5 = CL-SB-12B-01T:CL-SB-12B-01T; AVAILABILITY: Unavailable; DESCRIPTION: Switch Slide N.O./N.C. SPDT Top Slide 0.2A 12VDC Gull Wing SMD T/R; MF: Nidec Copal; MP: CL-SB-12B-01T; PACKAGE: None; PRICE: None
U1-U3 = RN42-I_RM:RN42-I/RM: Bluetooth 2.1 class 2 surface mount module with built in antenna; AVAILABILITY: Unavailable; DESCRIPTION: Bluetooth Module; MF: Microchip; MP: RN42-I/RM; PACKAGE: SMD-35 Roving Networks; PRICE: None
U$1 U$3-U$40 U$56-U$58 U$167-U$193 = cherrymx:CHERRY-MX: Cherry MX series keyswitch
U$2 = adafruit:ATMEGA32U4: http://www.ladyada.net/library/eagle
U$59 = AVR-ISP:AVR-ISP; AVAILABILITY: Unavailable; DESCRIPTION: Emulators / Simulators AVR USB IN CIRCUIT EMUL/PRGMR ISP; MF: Gravitech; MP: AVR-ISP; PACKAGE: None; PRICE: None
U$166 = MIC4680:MIC4680: MIC4680 1A 200kHz SuperSwitcher? DC/DC Buck Regulator in a SOIC-8 package. Fixed or adjustable output. !!!Untested!!! Specs @ http://www.micrel.com/page.do?page=/product-info/products/mic4680.shtml; AVAILABILITY: Unavailable; MF: Micrel; MP: MIC4680; PACKAGE: None; PRICE: None
X2 = MicroUSB:ZX62D-B-5PA8: Micro USB Type B Connector - Standard, Shell Through Hole Source: http://www.hirose.co.jp/cataloge_hp/ed_ZX_20140804.pdf; MF: Hirose; MPN: ZX62D-B-5PA8; OC_FARNELL: 2300438; OC_NEWARK: 69W0712
Y2 = quad:CRYSTAL: Crystals Various standard crystals. Proven footprints. Spark Fun Electronics SKU : COM-00534